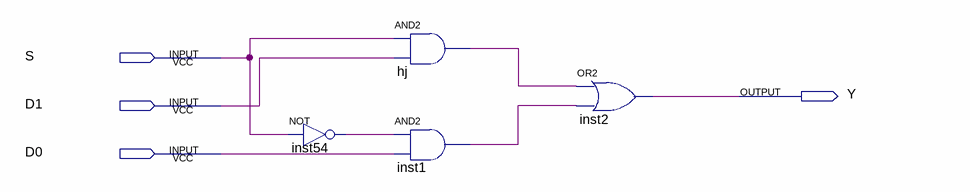
[diagram p0: schematic sheet]
// Quartus schematic mux2.bdf as structural Verilog: 4 symbols, 4 pins
module mux2 (
  input  S,
  input  D1,
  input  D0,
  output Y
);

  wire hj_out, inst1_out, inst54_out;

  not inst54 (inst54_out, S);
  and hj (hj_out, S, D1);
  and inst1 (inst1_out, inst54_out, D0);
  or inst2 (Y, hj_out, inst1_out);
endmodule
